# EasyEDA Pro project ProPrj_EMU Wiring Hatch Board Pubilc V1.0_2026-03-17.epro

# Board PCB1
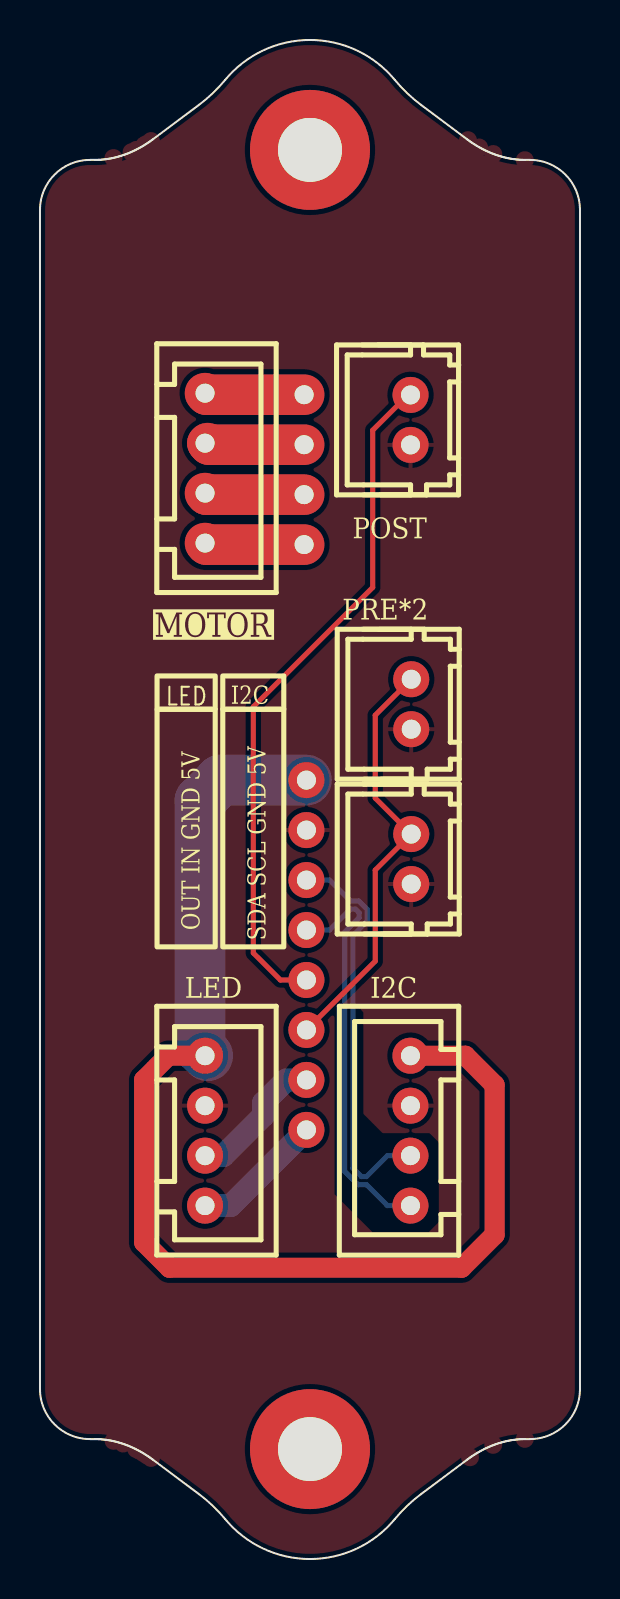
[diagram p0: board, top side]
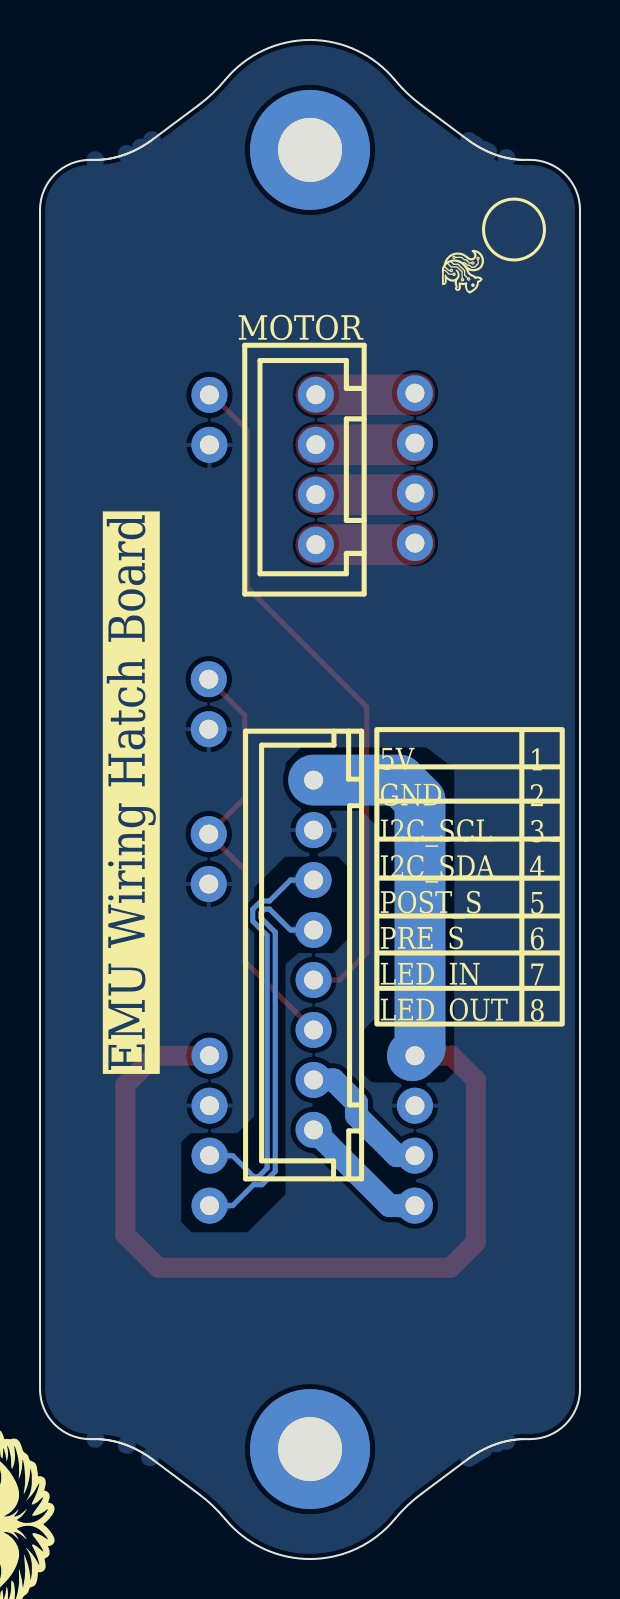
[diagram p1: board, bottom side, seen from below]

Outline 27 x 76 mm; copper layers: Top Layer, Bottom Layer. Coordinates in mm from the lower left corner of the outline.
Outline path: 0,67.5 0,8.5 arc(0.73,6.73) 2.5,6 2.76,6 2.82,6 2.88,6 2.94,6 3,5.99 3.06,5.99 3.12,5.98 3.19,5.98 3.25,5.97 3.31,5.96 3.37,5.95 3.43,5.94 3.49,5.93 3.55,5.92 3.61,5.91 3.67,5.9 3.73,5.88 3.79,5.87 3.86,5.85 3.92,5.84 3.98,5.82 4.04,5.8 4.1,5.78 4.16,5.76 4.22,5.74 4.28,5.72 4.34,5.7 4.39,5.67 4.45,5.65 4.51,5.63 4.57,5.6 4.63,5.57 4.69,5.55 4.75,5.52 4.81,5.49 4.86,5.46 4.92,5.43 4.98,5.4 5.04,5.37 5.09,5.33 5.15,5.3 5.21,5.26 5.27,5.23 5.32,5.19 5.38,5.16 5.43,5.12 5.49,5.08 5.54,5.04 5.6,5 5.65,4.96 7.92,3.27 arc(8.63,2.67) 9.26,2 arc(13.5,0) 17.74,2 arc(18.37,2.67) 19.08,3.27 21.35,4.96 21.4,5 21.46,5.04 21.51,5.08 21.57,5.12 21.62,5.16 21.68,5.19 21.73,5.23 21.79,5.26 21.85,5.3 21.91,5.33 21.96,5.37 22.02,5.4 22.08,5.43 22.14,5.46 22.19,5.49 22.25,5.52 22.31,5.55 22.37,5.57 22.43,5.6 22.49,5.63 22.55,5.65 22.6,5.67 22.66,5.7 22.72,5.72 22.78,5.74 22.84,5.76 22.9,5.78 22.96,5.8 23.02,5.82 23.08,5.84 23.14,5.85 23.2,5.87 23.27,5.88 23.33,5.9 23.39,5.91 23.45,5.92 23.51,5.93 23.57,5.94 23.63,5.95 23.69,5.96 23.75,5.97 23.81,5.98 23.88,5.98 23.94,5.99 24,5.99 24.06,6 24.12,6 24.18,6 24.24,6 24.5,6 arc(26.27,6.73) 27,8.5 27,67.5 arc(26.27,69.27) 24.5,70 24.24,70 24.18,70 24.12,70 24.06,70 24,70.01 23.94,70.01 23.88,70.02 23.81,70.02 23.75,70.03 23.69,70.04 23.63,70.05 23.57,70.06 23.51,70.07 23.45,70.08 23.39,70.09 23.33,70.1 23.27,70.12 23.2,70.13 23.14,70.15 23.08,70.16 23.02,70.18 22.96,70.2 22.9,70.22 22.84,70.24 22.78,70.26 22.72,70.28 22.66,70.3 22.6,70.32 22.55,70.35 22.49,70.37 22.43,70.4 22.37,70.43 22.31,70.45 22.25,70.48 22.19,70.51 22.14,70.54 22.08,70.57 22.02,70.6 21.96,70.63 21.85,70.7 21.79,70.73 21.73,70.77 21.68,70.81 21.62,70.84 21.57,70.88 21.51,70.92 21.46,70.96 21.4,71 21.35,71.04 19.08,72.73 arc(18.37,73.33) 17.74,74 arc(13.5,76) 9.26,74 arc(8.63,73.33) 7.92,72.73 5.65,71.04 5.6,71 5.54,70.96 5.49,70.92 5.43,70.88 5.38,70.84 5.32,70.81 5.27,70.77 5.21,70.73 5.15,70.7 5.09,70.67 5.04,70.63 4.98,70.6 4.92,70.57 4.86,70.54 4.81,70.51 4.75,70.48 4.69,70.45 4.63,70.43 4.57,70.4 4.51,70.37 4.45,70.35 4.39,70.32 4.34,70.3 4.28,70.28 4.22,70.26 4.16,70.24 4.1,70.22 4.04,70.2 3.98,70.18 3.92,70.16 3.86,70.15 3.79,70.13 3.73,70.12 3.67,70.1 3.61,70.09 3.55,70.08 3.49,70.07 3.43,70.06 3.37,70.05 3.31,70.04 3.25,70.03 3.19,70.02 3.12,70.02 3.06,70.01 3,70.01 2.94,70 2.88,70 2.82,70 2.76,70 2.5,70 arc(0.73,69.27) 0,67.5
Stack: Top Layer 0.035mm / Dielectric1 1.51mm FR4 er 4.5 / Bottom Layer 0.035mm

## Design rules (mm)
net SCL: DP1
net SDA: DP1
spacing copperThickness1oz (default): track to track 0.102, other pairs 0.152 to 0.3
spacing copperThickness2oz: track to track 0.203, other pairs 0.152 to 0.3
spacing Plane_innerPlane: track to track 0.102, other pairs 0.152 to 0.3
spacing Copper_copperRegion: track to track 0.102, other pairs 0.152 to 0.3
spacing Copper_copperRegion_copperThickness1oz: track to track 0.102, other pairs 0.152 to 0.3
spacing Copper_copperRegion_Copper_copperRegion: track to track 0.102, other pairs 0.152 to 0.3
track width copperThickness1oz (default): min 0.127, default 0.254, max 2.54
track width copperThickness2oz: min 0.203, default 0.254, max 2.54
differential pair differentialPair (default): width min 0.127, default 0.254, max 2.54; gap min 0.152, default 0.152
via viaSize (default): diameter min 0.5, default 0.61, max 10; hole min 0.3, default 0.305, max 6.3
net GND uses copperRegion_copperThickness1oz
net +5V uses copperRegion_copperThickness1oz
pour e127 uses Copper_copperRegion, copperRegion_Copper_copperRegion
pour e144 uses Copper_copperRegion, copperRegion_Copper_copperRegion
pour e88 uses Copper_copperRegion, copperRegion_Copper_copperRegion

## Placement (name value [footprint] x y rotation side)
CN4  PRE*2  [CONN-TH_2P-P2.50_HX25003-2A]  18.56 35.02 270 top
CN7  8p  [CONN-TH_8P-P2.50-XH2.54-8P]  13.32 30.22 270 bottom
I2C  SDA SCL GND 5V  [CONN-TH_4P-P2.50_4PIN]  18.52 21.43 90 top
LED  OUT IN GND 5V  [CONN-TH_4P-P2.50_4PIN]  8.25 21.43 270 top
MOTOR  STEP  [CONN-TH_4P-P2.50_4PIN]  13.21 54.5 90 bottom
MOTOR2  B2 B1 A1 A2  [CONN-TH_4P-P2.50_4PIN]  8.25 54.58 270 top
NOREF  -  [Pad_e2]  13.5 5.5 0 top
NOREF#2  -  [Pad_e1]  13.5 70.5 0 top
POST  GND S  [CONN-TH_2P-P2.50_HX25003-2A]  18.53 56.99 270 top
PRE*2  GND  S     GND  S  [CONN-TH_2P-P2.50_HX25003-2A]  18.56 42.77 270 top

## Footprints (pads in the part's own frame, mm; a bottom-side part is the same pattern mirrored in y, then rotated)
CONN-TH_2P-P2.50_HX25003-2A
  round 1.801 hole 0.95: 1(-1.25,0) 2(1.25,0)
CONN-TH_4P-P2.50_4PIN
  round 1.801 hole 0.95: 1(-3.75,0) 2(-1.25,0) 3(1.25,0) 4(3.75,0)
CONN-TH_8P-P2.50-XH2.54-8P
  round 1.801 hole 0.95: 1(8.75,0) 2(6.25,0) 3(3.75,0) 4(1.25,0) 5(-1.25,0) 6(-3.75,0) 7(-6.25,0) 8(-8.75,0)
Pad_e1
  round 6 hole 3.2: 1(0,0)
Pad_e2
  round 6 hole 3.2: 2(0,0)

## Nets
+5V: CN7.8 I2C.4 LED.1
GND: CN4.2 CN7.7 I2C.3 LED.2 POST.2 PRE*2.2
A+: MOTOR.3 MOTOR2.2
A-: MOTOR.4 MOTOR2.1
B+: MOTOR.2 MOTOR2.3
B-: MOTOR.1 MOTOR2.4
LED_IN: CN7.2 LED.3
LED_OUT: CN7.1 LED.4
PC14: CN7.4 POST.1
PC15: CN4.1 CN7.3 PRE*2.1
SCL: CN7.6 I2C.2
SDA: CN7.5 I2C.1

Pads without a net: NOREF 2; NOREF#2 1

## Routing (per net, layer and track width the routed paths; a pad name or vN(x,y) marks a point on that pad's centre or on a via; arc(x,y) is an arc through that point)
+5V: length 61.4
  Top Layer w1: LED.1 6.42,25.18 5.21,23.97 5.21,15.84 6.48,14.57 21.08,14.57 22.73,16.22 22.73,23.72 21.27,25.18 I2C.4
  Bottom Layer w2.54: CN7.8 9.03,38.97 8,37.94 8,25.56 8.38,25.18
A+: length 4.9
  Top Layer w2.032: 8.38,55.83 8.46,55.75 MOTOR.3
A-: length 5
  Top Layer w2.032: MOTOR.4 8.33,58.25 MOTOR2.1
B+: length 5
  Top Layer w2.032: MOTOR2.3 8.33,53.25 MOTOR.2
B-: length 5
  Top Layer w2.032: MOTOR2.4 8.33,50.75 MOTOR.1
LED_IN: length 6.9
  Bottom Layer w1.143: CN7.2 12.32,23.97 11.17,22.83 11.17,22.19 9.16,20.18 8.38,20.18
LED_OUT: length 6.5
  Bottom Layer w1.143: CN7.1 9.53,17.68 8.38,17.68
PC14: length 34.5
  Top Layer w0.254: CN7.4 12.02,28.97 10.67,30.32 10.67,42.64 16.64,48.61 16.64,56.47 18.53,58.37
PC15: length 21.2
  Top Layer w0.254: PRE*2.1 16.76,42.22 16.76,38.07 CN4.1 16.76,34.47 16.76,29.91 CN7.3
SCL: length 20.4
  Bottom Layer w0.254: CN7.6 14.48,33.97 15.52,32.92 15.94,32.92 16.36,32.5 16.36,31.91 15.64,31.2 15.64,19.56 16.07,19.13 16.32,19.13 17.37,20.18 I2C.2
SDA: length 20.4
  Bottom Layer w0.254: CN7.5 14.48,31.47 15.52,32.52 15.78,32.52 15.96,32.34 15.96,32.08 15.24,31.36 15.24,19.39 15.9,18.73 16.32,18.73 17.37,17.68 I2C.1

## Copper pours and planes (outline as drawn; the poured copper is in the pictures)
+5V on Bottom Layer: 13.85,37.83 10.96,37.83 9.9,36.76 9.9,27.05 10.79,26.13 10.79,24.57 10.31,24.1 6.9,24.1 6.55,24.45 6.54,39.42 7.79,40.35 13.84,40.35 14.48,39.72 14.48,38.45
GND on Top Layer: -6.61,77.95 32.38,77.95 32.38,-2.83 -6.61,-2.83
GND on Bottom Layer: -3.56,79.22 31.75,79.22 31.75,-0.92 -3.56,-0.92

Small or netless copper shapes (teardrops, artwork), in the pictures only: 6 on Bottom Layer

## Text on the board
Bottom Silkscreen Layer: 1 / 2 / 3 / 4 / 5 / 6 / 7 / 8 | 5V / GND / I2C_SCL / I2C_SDA / POST_S / PRE_S / LED_IN / LED_OUT | EMU Wiring Hatch Board
Top Silkscreen Layer: LED | I2C | OUT IN GND 5V | SDA SCL GND 5V | MOTOR
